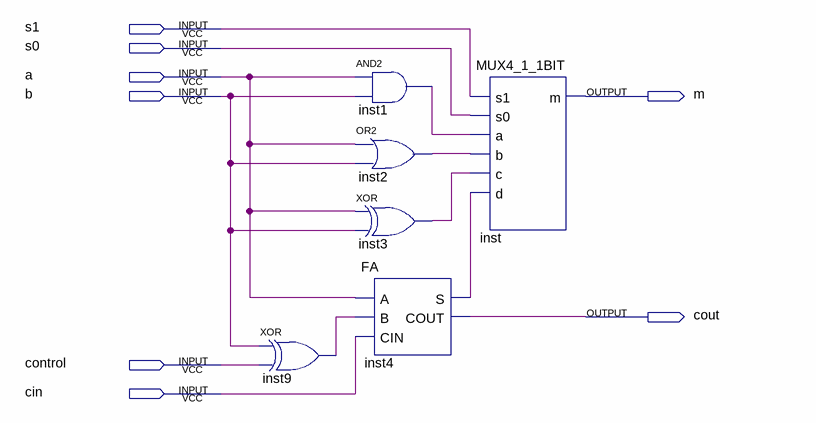
[diagram p0: schematic sheet]
// Quartus schematic ALU1BIT_4CN.bdf as structural Verilog: 6 symbols, 8 pins
module ALU1BIT_4CN (
  input  s1,
  input  s0,
  input  a,
  input  b,
  input  control,
  input  cin,
  output m,
  output cout
);

  wire inst1_out, inst2_out, inst3_out, inst4_s, inst9_out;

  xor inst9 (inst9_out, b, control);
  and inst1 (inst1_out, a, b);
  or inst2 (inst2_out, a, b);
  xor inst3 (inst3_out, a, b);
  FA inst4 (.A(a), .B(inst9_out), .CIN(cin), .S(inst4_s), .COUT(cout));
  MUX4_1_1BIT inst (.s1(s1), .s0(s0), .a(inst1_out), .b(inst2_out), .c(inst3_out), .d(inst4_s), .m(m));
endmodule
